# EAGLE design FL-Ver0.6 (EAGLE 6.3)
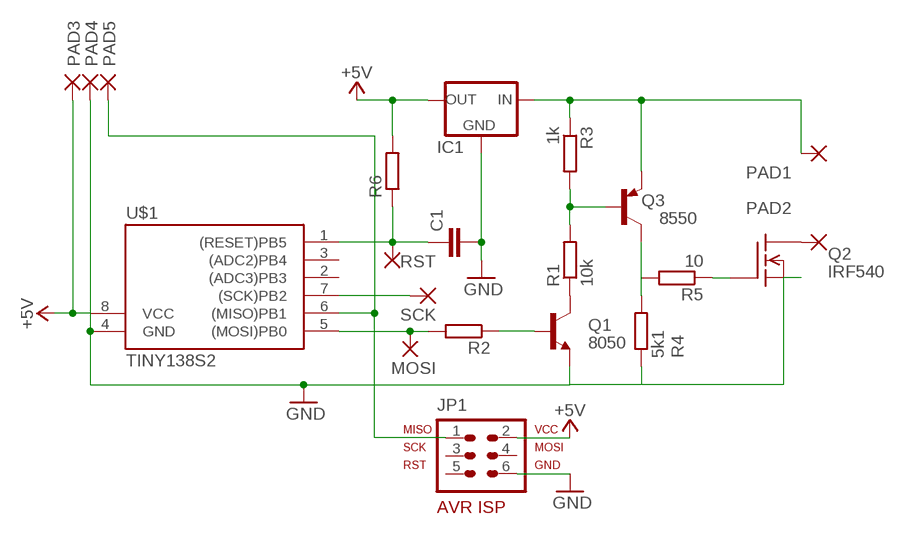
[diagram p0: schematic, sheet 1]

## Parts
C1  C-EUC0805  [C0805]
IC1  78MXXSDPACK  [DPACK]
JP1  AVR-ISP-6VERT  [AVR-ISP-6]
MOSI  1,6/0,8  [1,6/0,8]
PAD1  SMD5  [SMD2,54-5,08]
PAD2  SMD5  [SMD2,54-5,08]
PAD3  SMD5  [SMD2,54-5,08]
PAD4  SMD5  [SMD2,54-5,08]
PAD5  SMD5  [SMD2,54-5,08]
Q1  8050  -NPN-TO92-EBC  [TO92-EBC]
Q2  IRF540  [TO220]
Q3  8550  BC327-16-PNP-TO92-EBC  [TO92-EBC]
R1  10k  R-EU_0309/12  [0309/12]
R2  R-EU_0309/12  [0309/12]
R3  1k  R-EU_0309/12  [0309/12]
R4  5k1  R-EU_0309/12  [0309/12]
R5  10  R-EU_0309/12  [0309/12]
R6  R-EU_M0805  [M0805]
RST  1,6/0,8  [1,6/0,8]
SCK  1,6/0,8  [1,6/0,8]
U$1  TINY138S2  [SO08]

## Nets
+5V: IC1.3(OUT) JP1.2 PAD3.1(P) R6.2 U$1.8(VCC)
GND: C1.2 IC1.2(GND) JP1.6 PAD4.1(P) Q1.E Q2.3(S) R4.1 U$1.4(GND)
N$1: Q2.1(G) R5.1
N$2: SCK.1(P) U$1.7((SCK)PB2)
N$3: Q1.B R2.1
N$4: C1.1 R6.1 RST.1(P) U$1.1((RESET)PB5)
N$5: PAD2.1(P) Q2.2(D)
N$6: Q1.C R1.1
N$7: Q3.B R1.2 R3.2
N$8: Q3.C R4.2 R5.2
N$10: JP1.1 PAD5.1(P) U$1.6((MISO)PB1)
N$11: IC1.1(IN) PAD1.1(P) Q3.E R3.1
N$12: MOSI.1(P) R2.2 U$1.5((MOSI)PB0)
Unconnected: JP1.3 JP1.4 JP1.5 U$1.2((ADC3)PB3) U$1.3((ADC2)PB4)

## Library data of the parts
C1 = _myrc:C-EU: CAPACITOR, European symbol
IC1 = _mylbr:78MXXS: VOLTAGE REGULATOR
JP1 = _Atmel-avr-7:AVR-ISP-6: AVR ISP-6 Serial Programming Header
MOSI RST SCK = _wirepad:1,6/0,8: THROUGH-HOLE PAD
PAD1-PAD5 = _wirepad:SMD5: SMD PAD
Q1 = transistor:*-NPN-: NPN Transistror BF959 corrected 2008.03.06
Q2 = transistor-fet:IRF540: N-Channel Enhancement MOSFET (HEXFET); 100V; 28A; 0,077Ohm
Q3 = transistor:*-PNP-: PNP Transistror
R1-R6 = _myrc:R-EU_: RESISTOR, European symbol
U$1 = _Atmel-avr-7:TINY13*

## Board
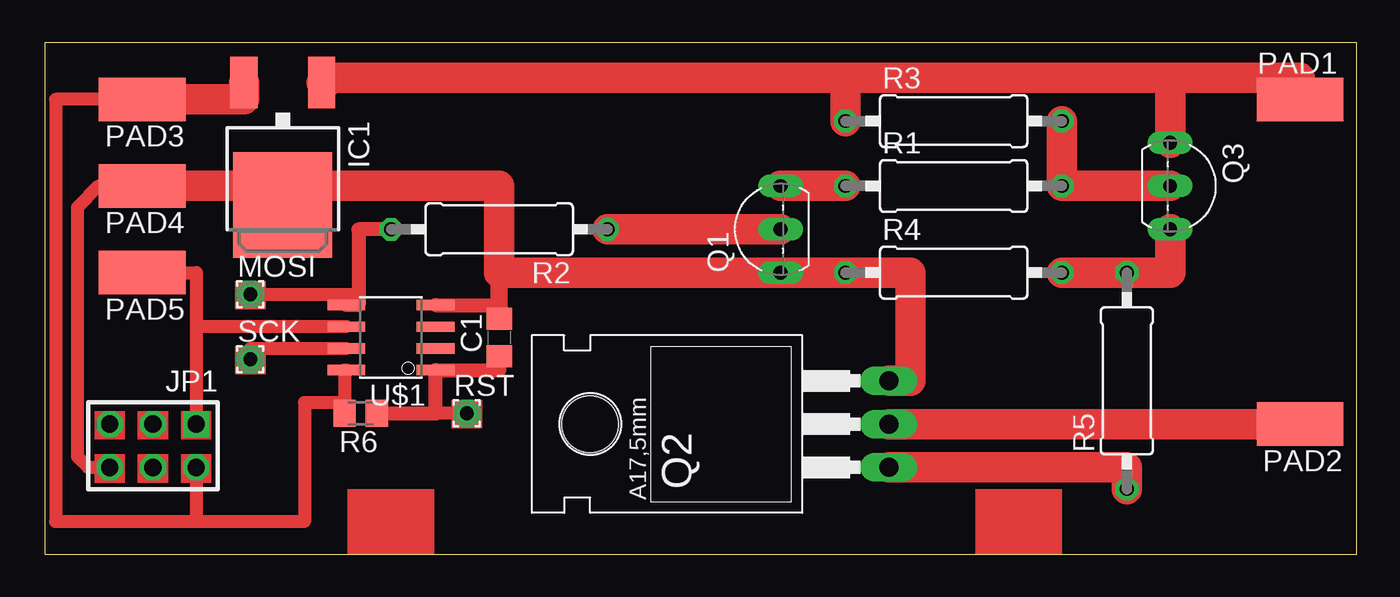
[diagram p1: board, top side]

Size 77 x 30 mm. Coordinates in mm from the lower left corner, seen from the top.
Outline: 0,0 77,0 77,30 0,30 0,0
Copper layers (1*16): Top 0.035mm / dielectric 1.5mm / Bottom 0.035mm
Design rules "default *": minimum track width 30mil, minimum drill 24mil, track to track 8mil, track to pad 8mil, pad to pad 8mil, via to via 8mil, smd to smd 8mil, copper to edge 40mil, drill to drill 8mil, minimum pad ring 10mil, minimum via ring 8mil, stop-mask expansion 4mil, vias tented up to drill 0mil, thermal gap 10mil

### Footprints (pad centres in the part's own frame; a part is rotated, then mirrored left to right if it is on the bottom)
C0805 = smd 1.3 x 1.5: 1 -1.104,0; 2 1.104,0
DPACK = smd 1.6 x 3: 1 -2.28,-4.8; 3 2.28,-4.8 | smd 5.8 x 6.2: 2 0,2.38
AVR-ISP-6 = drill 1.016 square: 1 -2.54,-1.27 | drill 1.016 octagon: 2 -2.54,1.27; 3 0,-1.27; 4 0,1.27; 5 2.54,-1.27; 6 2.54,1.27
1,6/0,8 = drill 0.813 pad 1.6 octagon: 1 0,0
SMD2,54-5,08 = smd 2.54 x 5.08: 1 0,0
TO92-EBC = drill 0.813 long: B 0,-1.27; C 2.54,-1.27; E -2.54,-1.27
TO220 = drill 1.118 long: 1 -2.54,-6.35; 2 0,-6.35; 3 2.54,-6.35 | hole 3.302: 0,11.176
0309/12 = drill 0.813 octagon: 1 -6.35,0; 2 6.35,0
M0805 = smd 1.3 x 1.6: 1 -0.95,0; 2 0.95,0
SO08 = smd 0.61 x 2.21: 1 -1.905,-2.616; 2 -0.635,-2.616; 3 0.635,-2.616; 4 1.905,-2.616; 5 1.905,2.616; 6 0.635,2.616; 7 -0.635,2.616; 8 -1.905,2.616

### Placement (x,y rotation side)
C1  26.67,12.7 90 top
IC1  13.97,22.86 180 top
JP1  6.35,6.35 180 top
MOSI  12.06,15.24 0 top
PAD1  73.66,26.67 270 top
PAD2  73.66,7.62 90 top
PAD3  5.71,26.67 90 top
PAD4  5.71,21.59 90 top
PAD5  5.71,16.51 90 top
Q1  41.91,19.05 90 top
Q2  43.18,7.62 90 top
Q3  67.31,21.59 270 top
R1  53.34,21.59 0 top
R2  26.67,19.05 180 top
R3  53.34,25.4 0 top
R4  53.34,16.51 0 top
R5  63.5,10.16 90 top
R6  18.54,8.26 180 top
RST  24.77,8.26 0 top
SCK  12.06,11.43 0 top
U$1  20.32,12.7 90 top

### Tracks (layer width: path | path; a pad name or v marks a point on that pad's centre or on a via)
+5V
  Top 0.762: PAD3.1 0.64,26.67 0.64,1.91 8.89,1.91 | JP1.2 8.89,1.91 | 8.89,1.91 15.24,1.91 15.24,8.89 17.59,8.89 R6.2 17.59,10.79 U$1.8
  Top 1.778: PAD3.1 11.69,26.67 IC1.3
GND
  Top 0.762: PAD4.1 3.17,21.59 1.91,20.32 1.91,5.71 2.54,5.08 JP1.6
  Top 0.813: U$1.4 26.67,14.61 26.67,15.24
  Top 1.016: C1.2 26.67,15.24 26.67,16.51
  Top 1.778: Q2.3 50.8,10.16 50.8,16.51 R4.1 Q1.E 26.67,16.51 26.67,21.59 13.97,21.59 | 13.97,21.59 IC1.2 | PAD4.1 13.97,21.59
N$1
  Top 1.778: Q2.1 63.5,5.08 R5.1
N$2
  Top 0.762: SCK.1 12.06,12.06 U$1.7
N$3
  Top 1.778: R2.1 Q1.B
N$4
  Top 0.762: RST.1 22.23,8.26
  Top 0.813: C1.1 26.67,10.79 U$1.1 22.94,8.26 22.23,8.26 R6.1
N$5
  Top 1.778: Q2.2 PAD2.1
N$6
  Top 1.778: Q1.C R1.1
N$7
  Top 1.778: R3.2 R1.2 Q3.B
N$8
  Top 1.778: Q3.C 66.04,16.51 R5.2 R4.2
N$10
  Top 0.762: PAD5.1 8.89,16.51 8.89,13.34 | 8.89,13.34 JP1.1 | U$1.6 8.89,13.34
N$11
  Top 1.778: IC1.1 16.51,27.66 16.51,27.94 46.99,27.94 | 46.99,27.94 R3.1 | PAD1.1 73.66,27.94 66.04,27.94 | 66.04,27.94 46.99,27.94 | Q3.E 66.04,27.94
N$12
  Top 0.762: MOSI.1 18.41,15.24
  Top 0.813: R2.2 18.41,19.05 18.41,15.24 18.41,14.61 U$1.5
(copper drawn outside any net)
  shapes: Top area x11